# EasyEDA schematic SCH_RGB LED stick th_2022-01-01.json
TITLE: Sheet_1; REV: 1.0; Date: 2021-12-29; Sheet: 1/1; Drawn By: limchengwei; Company: Your Company
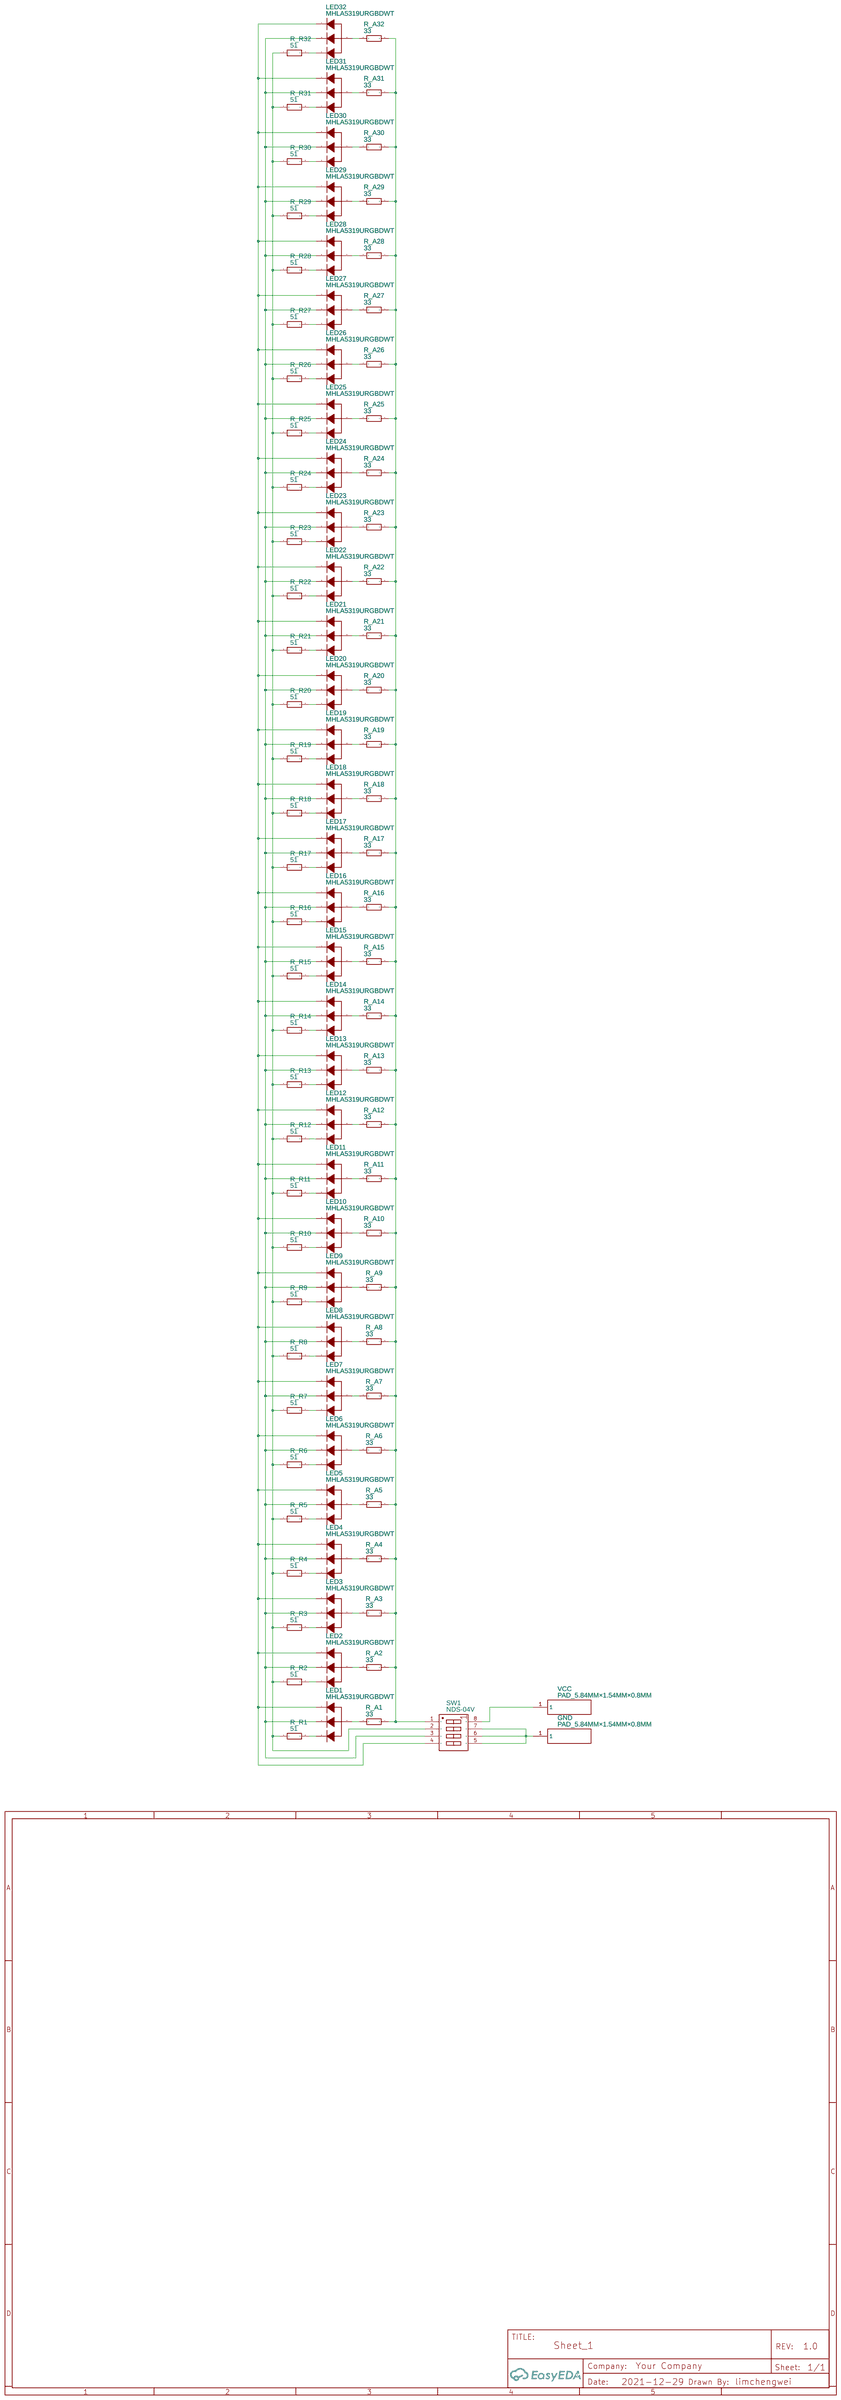
[diagram p0: schematic sheet]

## Parts
GND  PAD_5.84MM×1.54MM×0.8MM  [TESTPOINT-SMD_PAD_5.84MM-1.54MM-0.8MM]
LED1  MHLA5319URGBDWT  [LED-TH_4P-BD6.9-P1.27-R]
LED2  MHLA5319URGBDWT  [LED-TH_4P-BD6.9-P1.27-R]
LED3  MHLA5319URGBDWT  [LED-TH_4P-BD6.9-P1.27-R]
LED4  MHLA5319URGBDWT  [LED-TH_4P-BD6.9-P1.27-R]
LED5  MHLA5319URGBDWT  [LED-TH_4P-BD6.9-P1.27-R]
LED6  MHLA5319URGBDWT  [LED-TH_4P-BD6.9-P1.27-R]
LED7  MHLA5319URGBDWT  [LED-TH_4P-BD6.9-P1.27-R]
LED8  MHLA5319URGBDWT  [LED-TH_4P-BD6.9-P1.27-R]
LED9  MHLA5319URGBDWT  [LED-TH_4P-BD6.9-P1.27-R]
LED10  MHLA5319URGBDWT  [LED-TH_4P-BD6.9-P1.27-R]
LED11  MHLA5319URGBDWT  [LED-TH_4P-BD6.9-P1.27-R]
LED12  MHLA5319URGBDWT  [LED-TH_4P-BD6.9-P1.27-R]
LED13  MHLA5319URGBDWT  [LED-TH_4P-BD6.9-P1.27-R]
LED14  MHLA5319URGBDWT  [LED-TH_4P-BD6.9-P1.27-R]
LED15  MHLA5319URGBDWT  [LED-TH_4P-BD6.9-P1.27-R]
LED16  MHLA5319URGBDWT  [LED-TH_4P-BD6.9-P1.27-R]
LED17  MHLA5319URGBDWT  [LED-TH_4P-BD6.9-P1.27-R]
LED18  MHLA5319URGBDWT  [LED-TH_4P-BD6.9-P1.27-R]
LED19  MHLA5319URGBDWT  [LED-TH_4P-BD6.9-P1.27-R]
LED20  MHLA5319URGBDWT  [LED-TH_4P-BD6.9-P1.27-R]
LED21  MHLA5319URGBDWT  [LED-TH_4P-BD6.9-P1.27-R]
LED22  MHLA5319URGBDWT  [LED-TH_4P-BD6.9-P1.27-R]
LED23  MHLA5319URGBDWT  [LED-TH_4P-BD6.9-P1.27-R]
LED24  MHLA5319URGBDWT  [LED-TH_4P-BD6.9-P1.27-R]
LED25  MHLA5319URGBDWT  [LED-TH_4P-BD6.9-P1.27-R]
LED26  MHLA5319URGBDWT  [LED-TH_4P-BD6.9-P1.27-R]
LED27  MHLA5319URGBDWT  [LED-TH_4P-BD6.9-P1.27-R]
LED28  MHLA5319URGBDWT  [LED-TH_4P-BD6.9-P1.27-R]
LED29  MHLA5319URGBDWT  [LED-TH_4P-BD6.9-P1.27-R]
LED30  MHLA5319URGBDWT  [LED-TH_4P-BD6.9-P1.27-R]
LED31  MHLA5319URGBDWT  [LED-TH_4P-BD6.9-P1.27-R]
LED32  MHLA5319URGBDWT  [LED-TH_4P-BD6.9-P1.27-R]
R_A1  33  [RES-TH_BD2.3-L6.5-P10.50-D0.5]
R_A2  33  [RES-TH_BD2.3-L6.5-P10.50-D0.5]
R_A3  33  [RES-TH_BD2.3-L6.5-P10.50-D0.5]
R_A4  33  [RES-TH_BD2.3-L6.5-P10.50-D0.5]
R_A5  33  [RES-TH_BD2.3-L6.5-P10.50-D0.5]
R_A6  33  [RES-TH_BD2.3-L6.5-P10.50-D0.5]
R_A7  33  [RES-TH_BD2.3-L6.5-P10.50-D0.5]
R_A8  33  [RES-TH_BD2.3-L6.5-P10.50-D0.5]
R_A9  33  [RES-TH_BD2.3-L6.5-P10.50-D0.5]
R_A10  33  [RES-TH_BD2.3-L6.5-P10.50-D0.5]
R_A11  33  [RES-TH_BD2.3-L6.5-P10.50-D0.5]
R_A12  33  [RES-TH_BD2.3-L6.5-P10.50-D0.5]
R_A13  33  [RES-TH_BD2.3-L6.5-P10.50-D0.5]
R_A14  33  [RES-TH_BD2.3-L6.5-P10.50-D0.5]
R_A15  33  [RES-TH_BD2.3-L6.5-P10.50-D0.5]
R_A16  33  [RES-TH_BD2.3-L6.5-P10.50-D0.5]
R_A17  33  [RES-TH_BD2.3-L6.5-P10.50-D0.5]
R_A18  33  [RES-TH_BD2.3-L6.5-P10.50-D0.5]
R_A19  33  [RES-TH_BD2.3-L6.5-P10.50-D0.5]
R_A20  33  [RES-TH_BD2.3-L6.5-P10.50-D0.5]
R_A21  33  [RES-TH_BD2.3-L6.5-P10.50-D0.5]
R_A22  33  [RES-TH_BD2.3-L6.5-P10.50-D0.5]
R_A23  33  [RES-TH_BD2.3-L6.5-P10.50-D0.5]
R_A24  33  [RES-TH_BD2.3-L6.5-P10.50-D0.5]
R_A25  33  [RES-TH_BD2.3-L6.5-P10.50-D0.5]
R_A26  33  [RES-TH_BD2.3-L6.5-P10.50-D0.5]
R_A27  33  [RES-TH_BD2.3-L6.5-P10.50-D0.5]
R_A28  33  [RES-TH_BD2.3-L6.5-P10.50-D0.5]
R_A29  33  [RES-TH_BD2.3-L6.5-P10.50-D0.5]
R_A30  33  [RES-TH_BD2.3-L6.5-P10.50-D0.5]
R_A31  33  [RES-TH_BD2.3-L6.5-P10.50-D0.5]
R_A32  33  [RES-TH_BD2.3-L6.5-P10.50-D0.5]
R_R1  51  [RES-TH_BD2.3-L6.5-P10.50-D0.5]
R_R2  51  [RES-TH_BD2.3-L6.5-P10.50-D0.5]
R_R3  51  [RES-TH_BD2.3-L6.5-P10.50-D0.5]
R_R4  51  [RES-TH_BD2.3-L6.5-P10.50-D0.5]
R_R5  51  [RES-TH_BD2.3-L6.5-P10.50-D0.5]
R_R6  51  [RES-TH_BD2.3-L6.5-P10.50-D0.5]
R_R7  51  [RES-TH_BD2.3-L6.5-P10.50-D0.5]
R_R8  51  [RES-TH_BD2.3-L6.5-P10.50-D0.5]
R_R9  51  [RES-TH_BD2.3-L6.5-P10.50-D0.5]
R_R10  51  [RES-TH_BD2.3-L6.5-P10.50-D0.5]
R_R11  51  [RES-TH_BD2.3-L6.5-P10.50-D0.5]
R_R12  51  [RES-TH_BD2.3-L6.5-P10.50-D0.5]
R_R13  51  [RES-TH_BD2.3-L6.5-P10.50-D0.5]
R_R14  51  [RES-TH_BD2.3-L6.5-P10.50-D0.5]
R_R15  51  [RES-TH_BD2.3-L6.5-P10.50-D0.5]
R_R16  51  [RES-TH_BD2.3-L6.5-P10.50-D0.5]
R_R17  51  [RES-TH_BD2.3-L6.5-P10.50-D0.5]
R_R18  51  [RES-TH_BD2.3-L6.5-P10.50-D0.5]
R_R19  51  [RES-TH_BD2.3-L6.5-P10.50-D0.5]
R_R20  51  [RES-TH_BD2.3-L6.5-P10.50-D0.5]
R_R21  51  [RES-TH_BD2.3-L6.5-P10.50-D0.5]
R_R22  51  [RES-TH_BD2.3-L6.5-P10.50-D0.5]
R_R23  51  [RES-TH_BD2.3-L6.5-P10.50-D0.5]
R_R24  51  [RES-TH_BD2.3-L6.5-P10.50-D0.5]
R_R25  51  [RES-TH_BD2.3-L6.5-P10.50-D0.5]
R_R26  51  [RES-TH_BD2.3-L6.5-P10.50-D0.5]
R_R27  51  [RES-TH_BD2.3-L6.5-P10.50-D0.5]
R_R28  51  [RES-TH_BD2.3-L6.5-P10.50-D0.5]
R_R29  51  [RES-TH_BD2.3-L6.5-P10.50-D0.5]
R_R30  51  [RES-TH_BD2.3-L6.5-P10.50-D0.5]
R_R31  51  [RES-TH_BD2.3-L6.5-P10.50-D0.5]
R_R32  51  [RES-TH_BD2.3-L6.5-P10.50-D0.5]
SW1  NDS-04V  [SW-TH_8P-L11.8-W9.9-P2.54-LS7.6]
VCC  PAD_5.84MM×1.54MM×0.8MM  [TESTPOINT-SMD_PAD_5.84MM-1.54MM-0.8MM]

## Library data of the parts
GND VCC = PAD_5.84MM×1.54MM×0.8MM: Supplier: LCSC; Supplier Part: C9900000335; Manufacturer Part: PAD_5.84mm×1.54mm×0.8mm; JLCPCB Part Class: Extended Part; Contributor: LCSC
LED1-LED32 = MHLA5319URGBDWT: Supplier: LCSC; Supplier Part: C417349; Manufacturer: MEIHUA; Contributor: LCSC; JLCPCB Part Class: Extended Part
R_A1-R_A32 R_R1-R_R32 = MF1/4W-620Ω±1% T52: Supplier: LCSC; Supplier Part: C119319; Manufacturer: Chian Chia Elec; Contributor: LCSC
SW1 = NDS-04V: Supplier: LCSC; Supplier Part: C501536; Manufacturer: Diptronics; Contributor: LCSC; JLCPCB Part Class: Extended Part

## Nets
Net-(GND-1): GND.1 SW1.5(PIN5) SW1.6(PIN6) SW1.7(PIN7)
Net-(LED1-1): LED1.1(-) R_R1.2
Net-(LED1-2): LED1.2(+) R_A1.2
Net-(LED1-3): LED1.3(-) LED2.3(-) LED3.3(-) LED4.3(-) LED5.3(-) LED6.3(-) LED7.3(-) LED8.3(-) LED9.3(-) LED10.3(-) LED11.3(-) LED12.3(-) LED13.3(-) LED14.3(-) LED15.3(-) LED16.3(-) LED17.3(-) LED18.3(-) LED19.3(-) LED20.3(-) LED21.3(-) LED22.3(-) LED23.3(-) LED24.3(-) LED25.3(-) LED26.3(-) LED27.3(-) LED28.3(-) LED29.3(-) LED30.3(-) LED31.3(-) LED32.3(-) SW1.3(PIN3)
Net-(LED1-4): LED1.4(-) LED2.4(-) LED3.4(-) LED4.4(-) LED5.4(-) LED6.4(-) LED7.4(-) LED8.4(-) LED9.4(-) LED10.4(-) LED11.4(-) LED12.4(-) LED13.4(-) LED14.4(-) LED15.4(-) LED16.4(-) LED17.4(-) LED18.4(-) LED19.4(-) LED20.4(-) LED21.4(-) LED22.4(-) LED23.4(-) LED24.4(-) LED25.4(-) LED26.4(-) LED27.4(-) LED28.4(-) LED29.4(-) LED30.4(-) LED31.4(-) LED32.4(-) SW1.4(PIN4)
Net-(LED2-1): LED2.1(-) R_R2.2
Net-(LED2-2): LED2.2(+) R_A2.2
Net-(LED3-1): LED3.1(-) R_R3.2
Net-(LED3-2): LED3.2(+) R_A3.2
Net-(LED4-1): LED4.1(-) R_R4.2
Net-(LED4-2): LED4.2(+) R_A4.2
Net-(LED5-1): LED5.1(-) R_R5.2
Net-(LED5-2): LED5.2(+) R_A5.2
Net-(LED6-1): LED6.1(-) R_R6.2
Net-(LED6-2): LED6.2(+) R_A6.2
Net-(LED7-1): LED7.1(-) R_R7.2
Net-(LED7-2): LED7.2(+) R_A7.2
Net-(LED8-1): LED8.1(-) R_R8.2
Net-(LED8-2): LED8.2(+) R_A8.2
Net-(LED9-1): LED9.1(-) R_R9.2
Net-(LED9-2): LED9.2(+) R_A9.2
Net-(LED10-1): LED10.1(-) R_R10.2
Net-(LED10-2): LED10.2(+) R_A10.2
Net-(LED11-1): LED11.1(-) R_R11.2
Net-(LED11-2): LED11.2(+) R_A11.2
Net-(LED12-1): LED12.1(-) R_R12.2
Net-(LED12-2): LED12.2(+) R_A12.2
Net-(LED13-1): LED13.1(-) R_R13.2
Net-(LED13-2): LED13.2(+) R_A13.2
Net-(LED14-1): LED14.1(-) R_R14.2
Net-(LED14-2): LED14.2(+) R_A14.2
Net-(LED15-1): LED15.1(-) R_R15.2
Net-(LED15-2): LED15.2(+) R_A15.2
Net-(LED16-1): LED16.1(-) R_R16.2
Net-(LED16-2): LED16.2(+) R_A16.2
Net-(LED17-1): LED17.1(-) R_R17.2
Net-(LED17-2): LED17.2(+) R_A17.2
Net-(LED18-1): LED18.1(-) R_R18.2
Net-(LED18-2): LED18.2(+) R_A18.2
Net-(LED19-1): LED19.1(-) R_R19.2
Net-(LED19-2): LED19.2(+) R_A19.2
Net-(LED20-1): LED20.1(-) R_R20.2
Net-(LED20-2): LED20.2(+) R_A20.2
Net-(LED21-1): LED21.1(-) R_R21.2
Net-(LED21-2): LED21.2(+) R_A21.2
Net-(LED22-1): LED22.1(-) R_R22.2
Net-(LED22-2): LED22.2(+) R_A22.2
Net-(LED23-1): LED23.1(-) R_R23.2
Net-(LED23-2): LED23.2(+) R_A23.2
Net-(LED24-1): LED24.1(-) R_R24.2
Net-(LED24-2): LED24.2(+) R_A24.2
Net-(LED25-1): LED25.1(-) R_R25.2
Net-(LED25-2): LED25.2(+) R_A25.2
Net-(LED26-1): LED26.1(-) R_R26.2
Net-(LED26-2): LED26.2(+) R_A26.2
Net-(LED27-1): LED27.1(-) R_R27.2
Net-(LED27-2): LED27.2(+) R_A27.2
Net-(LED28-1): LED28.1(-) R_R28.2
Net-(LED28-2): LED28.2(+) R_A28.2
Net-(LED29-1): LED29.1(-) R_R29.2
Net-(LED29-2): LED29.2(+) R_A29.2
Net-(LED30-1): LED30.1(-) R_R30.2
Net-(LED30-2): LED30.2(+) R_A30.2
Net-(LED31-1): LED31.1(-) R_R31.2
Net-(LED31-2): LED31.2(+) R_A31.2
Net-(LED32-1): LED32.1(-) R_R32.2
Net-(LED32-2): LED32.2(+) R_A32.2
Net-(R_A1-1): R_A1.1 R_A2.1 R_A3.1 R_A4.1 R_A5.1 R_A6.1 R_A7.1 R_A8.1 R_A9.1 R_A10.1 R_A11.1 R_A12.1 R_A13.1 R_A14.1 R_A15.1 R_A16.1 R_A17.1 R_A18.1 R_A19.1 R_A20.1 R_A21.1 R_A22.1 R_A23.1 R_A24.1 R_A25.1 R_A26.1 R_A27.1 R_A28.1 R_A29.1 R_A30.1 R_A31.1 R_A32.1 SW1.1(PIN1)
Net-(R_R1-1): R_R1.1 R_R2.1 R_R3.1 R_R4.1 R_R5.1 R_R6.1 R_R7.1 R_R8.1 R_R9.1 R_R10.1 R_R11.1 R_R12.1 R_R13.1 R_R14.1 R_R15.1 R_R16.1 R_R17.1 R_R18.1 R_R19.1 R_R20.1 R_R21.1 R_R22.1 R_R23.1 R_R24.1 R_R25.1 R_R26.1 R_R27.1 R_R28.1 R_R29.1 R_R30.1 R_R31.1 R_R32.1 SW1.2(PIN2)
Net-(SW1-8): SW1.8(PIN8) VCC.1
